# Altium schematic sheet REF_CPU_STM32_B1.SchDoc
size A4; SheetNumber: 4; SheetTotal: 8
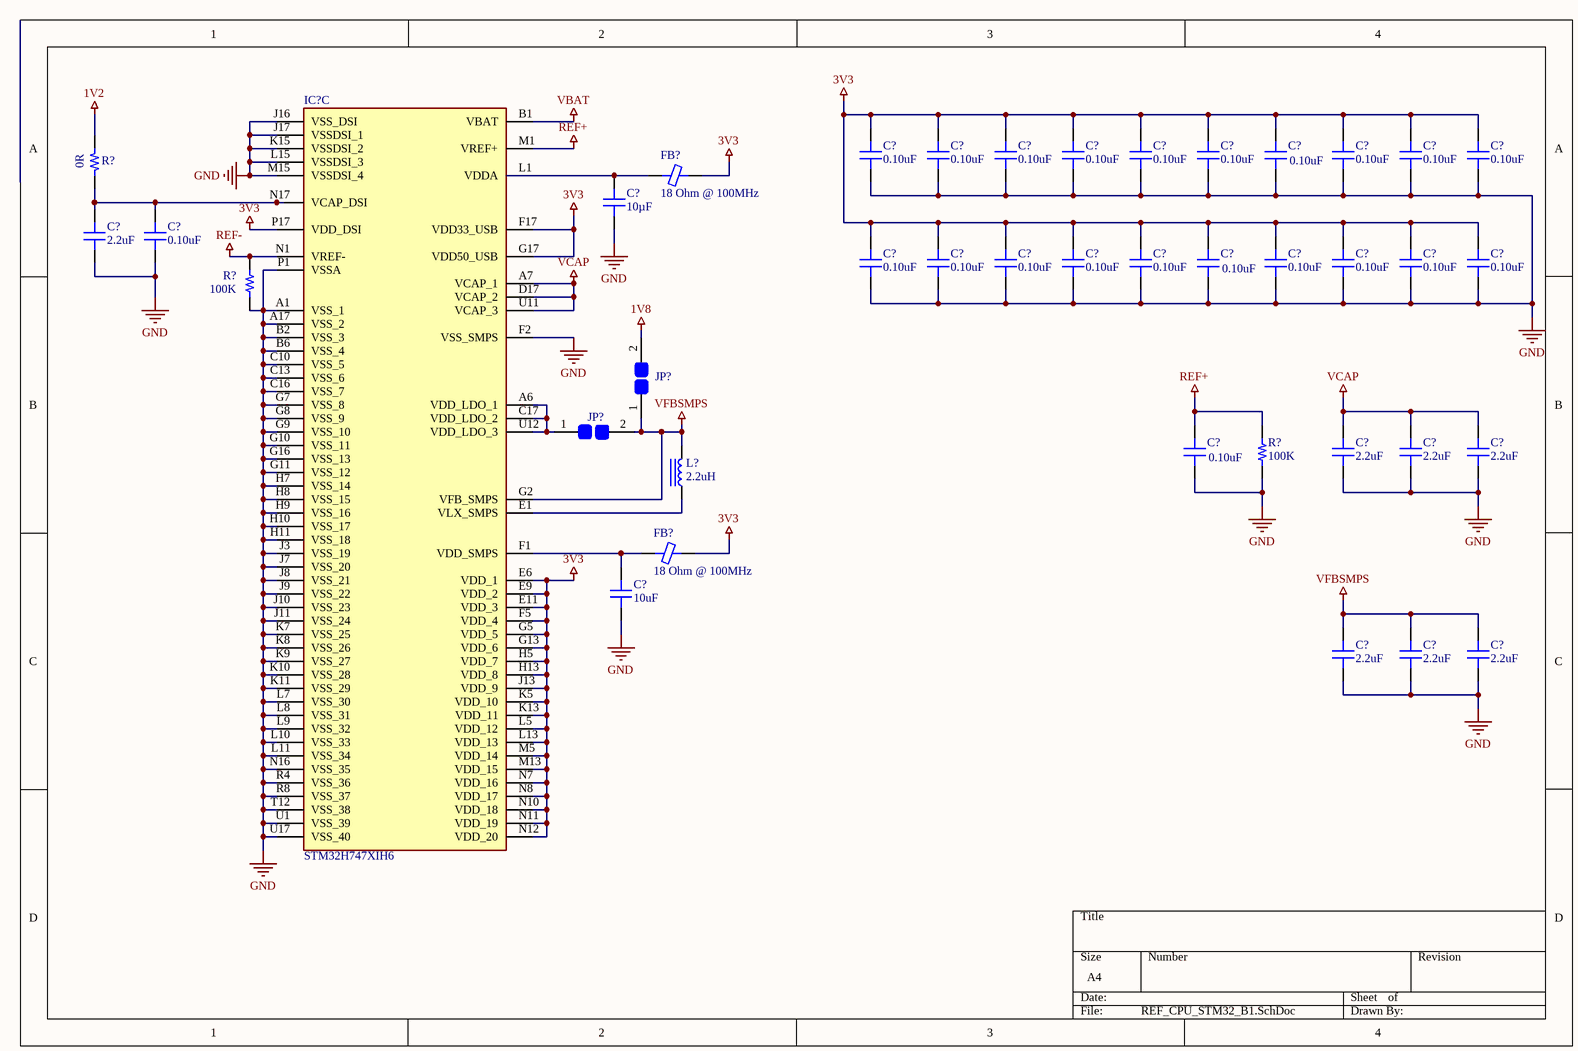
[diagram p0: REF_CPU_STM32_B1.SchDoc]

## Parts
(Parts that share a designator on the sheet are numbered #1, #2 ... from top to bottom, then left to right.)
C?#1  0.10uF  [CAP 0603/1608]
C?#2  0.10uF  [CAP 0603/1608]
C?#3  0.10uF  [CAP 0603/1608]
C?#4  0.10uF  [CAP 0603/1608]
C?#5  0.10uF  [CAP 0603/1608]
C?#6  0.10uF  [CAP 0603/1608]
C?#7  0.10uF  [CAP 0603/1608]
C?#8  0.10uF  [CAP 0603/1608]
C?#9  0.10uF  [CAP 0603/1608]
C?#10  0.10uF  [CAP 0603/1608]
C?#11  10µF  [CAP 0805_2012]
C?#12  2.2uF  [CAP 0603/1608]
C?#13  0.10uF  [CAP 0603/1608]
C?#14  0.10uF  [CAP 0603/1608]
C?#15  0.10uF  [CAP 0603/1608]
C?#16  0.10uF  [CAP 0603/1608]
C?#17  0.10uF  [CAP 0603/1608]
C?#18  0.10uF  [CAP 0603/1608]
C?#19  0.10uF  [CAP 0603/1608]
C?#20  0.10uF  [CAP 0603/1608]
C?#21  0.10uF  [CAP 0603/1608]
C?#22  0.10uF  [CAP 0603/1608]
C?#23  0.10uF  [CAP 0603/1608]
C?#24  0.10uF  [CAP 0603/1608]
C?#25  2.2uF  [CAP 0603/1608]
C?#26  2.2uF  [CAP 0603/1608]
C?#27  2.2uF  [CAP 0603/1608]
C?#28  10uF  [CAP 1206/3216]
C?#29  2.2uF  [CAP 0603/1608]
C?#30  2.2uF  [CAP 0603/1608]
C?#31  2.2uF  [CAP 0603/1608]
FB?#1  18 Ohm @ 100MHz  [FER 0603/1608]
FB?#2  18 Ohm @ 100MHz  [FER 0603/1608]
IC?  STM32H747XIH6  [BGA265C80P17X17_1400X1400X110]  (part C of 3)
JP?#1  68786-202LF  [FCI_68786-202LF]  (value not drawn)
JP?#2  68786-202LF  [FCI_68786-202LF]  (value not drawn)
L?  2.2uH  [WURTH WE-HCI 7040]
R?#1  0R  [STACKPOLE CSR2010]
R?#2  100K  [RES 0603/1608]
R?#3  100K  [RES 0603/1608]

## Nets
1V2: R?#1.2
1V8: JP?#1.2
3V3: C?#1.2 C?#2.2 C?#3.2 C?#4.2 C?#5.2 C?#6.2 C?#7.2 C?#8.2 C?#9.2 C?#10.2 C?#14.2 C?#15.2 C?#16.2 C?#17.2 C?#18.2 C?#19.2 C?#20.2 C?#21.2 C?#22.2 C?#23.2 FB?#1.2 FB?#2.2 IC?.E6(VDD_1) IC?.E9(VDD_2) IC?.E11(VDD_3) IC?.F5(VDD_4) IC?.F17(VDD33_USB) IC?.G5(VDD_5) IC?.G13(VDD_6) IC?.H5(VDD_7) IC?.H13(VDD_8) IC?.J13(VDD_9) IC?.K5(VDD_10) IC?.K13(VDD_11) IC?.L5(VDD_12) IC?.L13(VDD_13) IC?.M5(VDD_14) IC?.M13(VDD_15) IC?.N7(VDD_16) IC?.N8(VDD_17) IC?.N10(VDD_18) IC?.N11(VDD_19) IC?.N12(VDD_20) IC?.P17(VDD_DSI)
GND: C?#1.1 C?#2.1 C?#3.1 C?#4.1 C?#5.1 C?#6.1 C?#7.1 C?#8.1 C?#9.1 C?#10.1 C?#11.1 C?#12.1 C?#13.1 C?#14.1 C?#15.1 C?#16.1 C?#17.1 C?#18.1 C?#19.1 C?#20.1 C?#21.1 C?#22.1 C?#23.1 C?#24.1 C?#25.1 C?#26.1 C?#27.1 C?#28.1 C?#29.1 C?#30.1 C?#31.1 IC?.A1(VSS_1) IC?.A17(VSS_2) IC?.B2(VSS_3) IC?.B6(VSS_4) IC?.C10(VSS_5) IC?.C13(VSS_6) IC?.C16(VSS_7) IC?.F2(VSS_SMPS) IC?.G7(VSS_8) IC?.G8(VSS_9) IC?.G9(VSS_10) IC?.G10(VSS_11) IC?.G11(VSS_12) IC?.G16(VSS_13) IC?.H7(VSS_14) IC?.H8(VSS_15) IC?.H9(VSS_16) IC?.H10(VSS_17) IC?.H11(VSS_18) IC?.J3(VSS_19) IC?.J7(VSS_20) IC?.J8(VSS_21) IC?.J9(VSS_22) IC?.J10(VSS_23) IC?.J11(VSS_24) IC?.J16(VSS_DSI) IC?.J17(VSSDSI_1) IC?.K7(VSS_25) IC?.K8(VSS_26) IC?.K9(VSS_27) IC?.K10(VSS_28) IC?.K11(VSS_29) IC?.K15(VSSDSI_2) IC?.L7(VSS_30) IC?.L8(VSS_31) IC?.L9(VSS_32) IC?.L10(VSS_33) IC?.L11(VSS_34) IC?.L15(VSSDSI_3) IC?.M15(VSSDSI_4) IC?.N16(VSS_35) IC?.P1(VSSA) IC?.R4(VSS_36) IC?.R8(VSS_37) IC?.T12(VSS_38) IC?.U1(VSS_39) IC?.U17(VSS_40) R?#2.2 R?#3.1
REF+: C?#24.2 IC?.M1(VREF+) R?#3.2
REF-: IC?.N1(VREF-) R?#2.1
VBAT: IC?.B1(VBAT)
VCAP: C?#25.2 C?#26.2 C?#27.2
VFBSMPS: C?#29.2 C?#30.2 C?#31.2 IC?.G2(VFB_SMPS) JP?#1.1 JP?#2.2 L?.2
NetC?#11_2: C?#11.2 FB?#1.1 IC?.L1(VDDA)
NetC?#12_2: C?#12.2 C?#13.2 IC?.N17(VCAP_DSI) R?#1.1
NetC?#28_2: C?#28.2 FB?#2.1 IC?.F1(VDD_SMPS)
NetIC?_A6: IC?.A6(VDD_LDO_1) IC?.C17(VDD_LDO_2) IC?.U12(VDD_LDO_3) JP?#2.1
NetIC?_E1: IC?.E1(VLX_SMPS) L?.1

Not connected (* = marked no-connect by the designer): IC? A7(VCAP_1) D17(VCAP_2) G17(VDD50_USB) U11(VCAP_3)

## Library data of the parts
C?#1-C?#10 C?#13-C?#24 = CL10B104KA8NNNC: CAP CER 0.1UF 25V X7R 0603; Manufacturer: Samsung Electro-Mechanics America, Inc.; TemperatureRange: -55C ~ 125C; Tolerance: 10%; Value: 0.10uF; Part Number: CL10B104KA8NNNC; PartId: 13014; Supplier 1: Digi-Key; Supplier Part Number 1: 1276-1006-2-ND; ComponentLink1Description: Datasheet; ComponentLink1URL: http://www.samsungsem.com/kr/support/product-search/mlcc/CL10B104KA8NNNC.jsp; ComponentLink2Description: Digi-Key Listing; ComponentLink2URL: https://www.digikey.com/product-detail/en/samsung-electro-mechanics-america-inc/CL10B104KA8NNNC/1276-1006-2-ND/3886664; TemperatureCoefficient: X7R; Voltage: 25V; Price: 0.0035; Device Package: 0603 (1608 Metric)
C?#11 = 08053D106MAT4A: CAP CER 10UF 25V X5R 0805; Manufacturer: AVX Corporation; Tolerance: ±20%; Part Number: 08053D106MAT4A; Value: 10µF; Applications: General Purpose; Capacitance: 10µF; ComponentLink1Description: Datasheet; ComponentLink1URL: http://datasheets.avx.com/cx5r.pdf; ComponentLink2Description: DigiKey Link; ComponentLink2URL: http://digikey.com/product-detail/en/avx-corporation/08053D106MAT4A/478-11515-1-ND/8107716; Device Package: 0805 (2012 Metric); LastUpdated: 9/2/2020 1:04:09 AM; Lifecycle Status: Active; Minimum Order: 1; Mounting Type: Surface Mount, MLCC; Operating Temperature: -55°C ~ 85°C; Package / Case: 0805 (2012 Metric); Packaging: TapeAndReel; PartId: 17345; Part Status: Active; Price: 0.13; Series: -; Size / Dimension: 0.079" L x 0.049" W (2.01mm x 1.25mm); Supplier 1: DigiKey; Supplier Part Number 1: 478-11515-1-ND; Temperature Coefficient: X5R; Thickness (Max): 0.060" (1.52mm); Voltage - Rated: 25V
C?#12 C?#25-C?#27 C?#29-C?#31 = CL10B225KP8NNNC: CAP CER 2.2UF 10V X7R 0603; Manufacturer: Samsung Electro-Mechanics America, Inc.; TemperatureRange: -55C ~ 125C; Tolerance: 10%; Value: 2.2uF; Part Number: CL10B225KP8NNNC; PartId: 13201; Supplier 1: Digi-Key; Supplier Part Number 1: 1276-1134-2-ND; ComponentLink1Description: Datasheet; ComponentLink1URL: http://www.samsungsem.com/kr/support/product-search/mlcc/CL10B225KP8NNNC.jsp; ComponentLink2Description: Digi-Key Listing; ComponentLink2URL: https://www.digikey.com/product-detail/en/samsung-electro-mechanics-america-inc/CL10B225KP8NNNC/1276-1134-2-ND/3886792; TemperatureCoefficient: X7R; Voltage: 10V; Price: 0.0247; Device Package: 0603 (1608 Metric)
C?#28 = CL31B106KLHNFNE: CAP CER 10UF 35V X7R 1206; Manufacturer: Samsung Electro-Mechanics America, Inc.; TemperatureRange: -55C ~ 125C; Tolerance: 10%; Value: 10uF; Part Number: CL31B106KLHNFNE; PartId: 16006; Supplier 1: Digi-Key; Supplier Part Number 1: 1276-3102-2-ND; ComponentLink1Description: Datasheet; ComponentLink1URL: http://www.samsungsem.com/kr/support/product-search/mlcc/CL31B106KLHNFNE.jsp; ComponentLink2Description: Digi-Key Listing; ComponentLink2URL: https://www.digikey.com/product-detail/en/samsung-electro-mechanics-america-inc/CL31B106KLHNFNE/1276-3102-2-ND/3888760; TemperatureCoefficient: X7R; Voltage: 35V; Price: 0.3179; Device Package: 1206 (3216 Metric)
FB?#1 FB?#2 = FBMJ1608HM180NTR: FERRITE CHIP 18 OHM 0603; Manufacturer: Taiyo Yuden; Type: Differential Mode - Single; DC Resistance: 4 mOhm Max; Current Rating: 7.5A; Part Number: FBMJ1608HM180NTR; PartId: 6728; Value: 18 Ohm @ 100MHz; Supplier 1: Digi-Key; Supplier Part Number 1: 587-3251-2-ND; ComponentLink1Description: Datasheet; ComponentLink1URL: http://ds.yuden.co.jp/TYCOMPAS/ut/detail.do?productNo=FBMJ1608HM180NTR&fileName=FBMJ1608HM180NTR_SS&mode=specSheetDownload; ComponentLink2Description: Digi-Key listing; ComponentLink2URL: http://digikey.com/product-detail/en/FBMJ1608HM180NTR/587-3251-2-ND/3662188; Price: 0.0409; Device Package: 0603 (1608 Metric)
IC? = STM32H747XIH6: CPU Dual core. • 32-bit Arm® Cortex®-M7; Manufacturer_Name: STMicroelectronics; Datasheet Link: https://www.st.com/en/microcontrollers-microprocessors/stm32h747xi.html; Height: 1.1mm; Manufacturer_Part_Number: STM32H747XIH6; Mouser Part Number: 511-STM32H747XIH6; Mouser Price/Stock: https://www.mouser.co.uk/ProductDetail/STMicroelectronics/STM32H747XIH6?qs=vLWxofP3U2xQGncZcDDLHQ%3D%3D; Arrow Part Number: STM32H747XIH6; Arrow Price/Stock: https://www.arrow.com/en/products/stm32h747xih6/stmicroelectronics?region=nac
JP?#1 JP?#2 = 68786-202LF: Jumper Low Profile , Single Row, 2 Positions, 2.54mm (0.100in) Pitch; MF: FCI; SnapEDA_Link: https://www.snapeda.com/parts/68786-202LF/Framatome%20Connectors/view-part/4792913/?ref=snap; MP: 68786-202LF; Price: None; Package: None; Value: *; Check_prices: https://www.snapeda.com/parts/68786-202LF/Framatome%20Connectors/view-part/4792913/?ref=eda; Purchase-URL: https://pricing.snapeda.com/search/part/68786-202LF/?ref=eda; Availability: Good
L? = 744311220: FIXED IND 2.2UH 9A 11.4 MOHM SMD; Manufacturer: Wurth Electronics Inc; Type: Wirewound; Tolerance: 20%; Shielding: Shielded; Frequency - Self Resonant: 52MHz; Value: 2.2uH; Part Number: 744311220; PartId: 9682; Supplier 1: Digi-Key; Supplier Part Number 1: 732-1151-2-ND; ComponentLink1Description: Datasheet; ComponentLink1URL: http://katalog.we-online.de/pbs/datasheet/744311220.pdf; ComponentLink2Description: Digi-Key Listing; ComponentLink2URL: https://www.digikey.com/product-detail/en/744311220/732-1151-2-ND/1638556; Price: 2.85; Device Package: Nonstandard; Series: WE-HCI; Inductance: 2.2uH; Current Rating: 9A; DC Resistance (DCR): 11.4 mOhm; Q @ Freq: -; Operating Temperature: -40C ~ 150C
R?#1 = CSNL2010FT1L00: RES SMD 0.001 OHM 1% 1.5W 2010; Manufacturer: Stackpole Electronics Inc.; Value: 0.001; TemperatureRange: -55C ~ 170C; TemperatureCoefficient: 50ppm/C; Part Number: CSNL2010FT1L00; PartId: 21549; Supplier 1: Digi-Key; Supplier Part Number 1: CSNL2010FT1L00TR-ND; ComponentLink1Description: Datasheet; ComponentLink1URL: https://www.seielect.com/Catalog/SEI-csnl.pdf; ComponentLink2Description: Digi-Key Listing; ComponentLink2URL: https://www.digikey.com/product-detail/en/stackpole-electronics-inc/CSNL2010FT1L00/CSNL2010FT1L00TR-ND/1788095; Tolerance: 1%; PowerRating: 1.5W; Price: 0.1862; Device Package: 2010 (5025 Metric)
R?#2 R?#3 = 0603S8J0104: RES SMD 100K OHM 5% 1/8W 0603; Manufacturer: Uniohm; TemperatureRange: -55C ~ 155C; TemperatureCoefficient: 100ppm/C; PowerRating: 0.125W, 1/8W; Value: 100K; Part Number: 0603S8J0104; Tolerance: 5%; Price: 0.0089; Device Package: 1608 (0603 Metric)